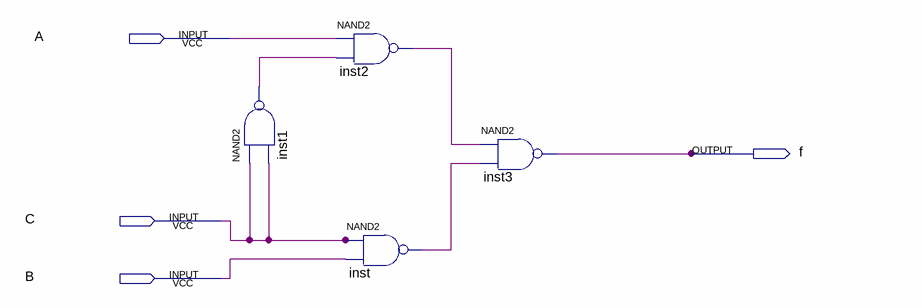
[diagram p0: schematic sheet]
// Quartus schematic Problema43.bdf as structural Verilog: 4 symbols, 4 pins
module Problema43 (
  input  A,
  input  C,
  input  B,
  output f
);

  wire inst1_out, inst2_out, inst_out;

  nand inst1 (inst1_out, C, C);
  nand inst2 (inst2_out, A, inst1_out);
  nand inst (inst_out, C, B);
  nand inst3 (f, inst2_out, inst_out);
endmodule
